# Altium schematic sheet Buck.SchDoc: Buck Converter
size Letter; DrawnBy: Adrianna Ascalon; Organization: UW Robotics; Address1: 200 University Avenue; Address2: Waterloo; Address3: Ontario; Address4: Canada N2L 3G6; SheetNumber: 1; SheetTotal: 2
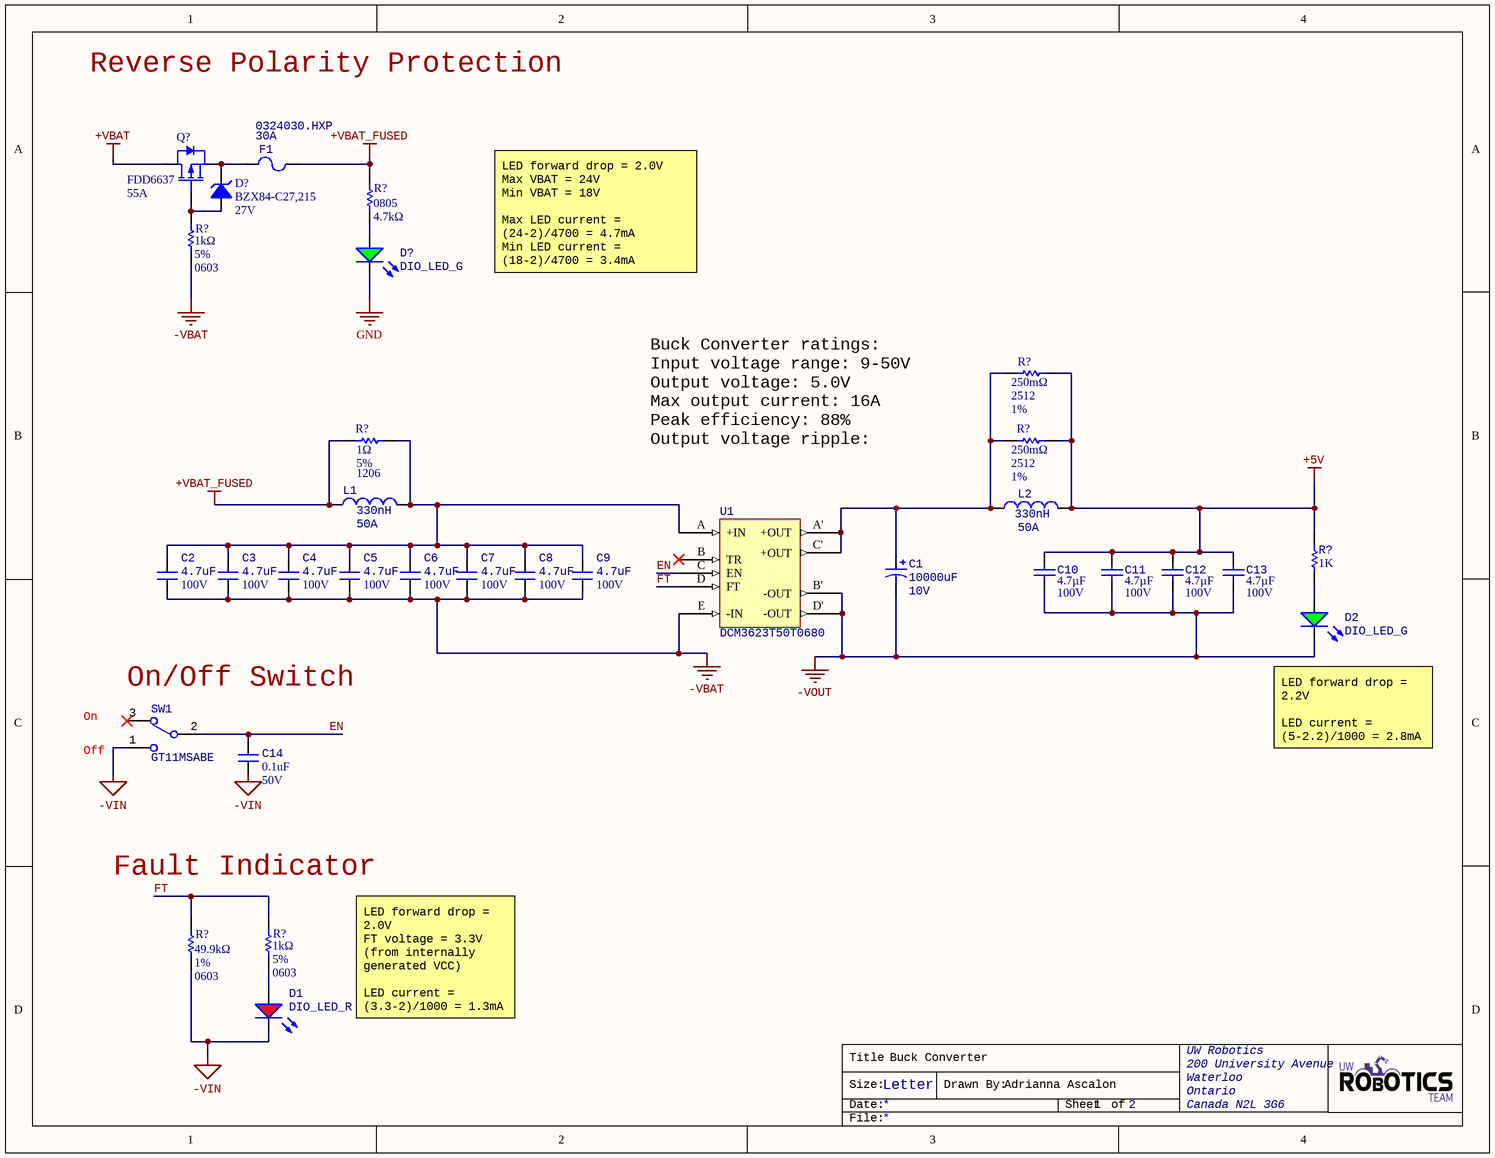
[diagram p0: Buck.SchDoc]

## Parts
(Parts that share a designator on the sheet are numbered #1, #2 ... from top to bottom, then left to right.)
C1  Capacitance: 10000uF  Voltage Rating: 10V  [CAP_UBY_18X25_NC]  (hidden comment: URS1A103MHD1TN)
C2  4.7uF  Voltage Rating: 100V  [CAPC5750X7R2A]
C3  4.7uF  Voltage Rating: 100V  [CAPC5750X7R2A]
C4  4.7uF  Voltage Rating: 100V  [CAPC5750X7R2A]
C5  4.7uF  Voltage Rating: 100V  [CAPC5750X7R2A]
C6  4.7uF  Voltage Rating: 100V  [CAPC5750X7R2A]
C7  4.7uF  Voltage Rating: 100V  [CAPC5750X7R2A]
C8  4.7uF  Voltage Rating: 100V  [CAPC5750X7R2A]
C9  4.7uF  Voltage Rating: 100V  [CAPC5750X7R2A]
C10  Capacitance: 4.7µF  Voltage Rating: 100V  [CAPC3216X190X50NL20T25]  (hidden comment: 12061Z475KAT2A)
C11  Capacitance: 4.7µF  Voltage Rating: 100V  [CAPC3216X190X50NL20T25]  (hidden comment: 12061Z475KAT2A)
C12  Capacitance: 4.7µF  Voltage Rating: 100V  [CAPC3216X190X50NL20T25]  (hidden comment: 12061Z475KAT2A)
C13  Capacitance: 4.7µF  Voltage Rating: 100V  [CAPC3216X190X50NL20T25]  (hidden comment: 12061Z475KAT2A)
C14  value 0.1uF  Voltage Rating: 50V  [CAPC0603(1608)55_N]  (hidden comment: CAP_0.1uF_50V_0603)
D1  DIO_LED_R  [LED_0805_LINE]
D2  DIO_LED_G  [LED_0805_LINE]
D?#1  Manufacturer Part Number 1: BZX84-C27,215  Working Voltage: 27V  [SOT23-3]  (hidden comment: DIO_ZENER_27V)
D?#2  DIO_LED_G  [LED_0805_LINE]
F1  0324030.HXP  Fuse Current: 30A
L1  Max DC Current: 50A  Inductance: 330nH  [WE-HCM 1390]  (hidden comment: 744309033)
L2  Max DC Current: 50A  Inductance: 330nH  [WE-HCM 1390]  (hidden comment: 744309033)
Q?  Continuous Drain Current (ID): 55A  (hidden comment: FDD6637)
R?#1  value 4.7kΩ  Case Code (Imperial): 0805  [RESC2012X60N]  (hidden comment: RES_4.7kΩ_0805)
R?#2  value 1kΩ  Tolerance: 5%  Case/Package: 0603  [RESC0603(1608)_N]  (hidden comment: RES_1kΩ_0603)
R?#3  Package Reference: 2512  Resistance Tolerance: 1%  Resistance: 250mΩ  [RESC6432X89X76NL25T25]  (hidden comment: WSL2512R2500FEA)
R?#4  Tolerance: 5%  Case Code (Imperial): 1206  Resistance: 1Ω  [RESC1206(3216)_N]  (hidden comment: RES_1Ω_1206)
R?#5  Package Reference: 2512  Resistance Tolerance: 1%  Resistance: 250mΩ  [RESC6432X89X76NL25T25]  (hidden comment: WSL2512R2500FEA)
R?#6  value 1K  [RESC0603(1608)_N]  (hidden comment: RES_1K_0603)
R?#7  Tolerance: 1%  Case/Package: 0603  Resistance: 49.9kΩ  [RESC0603(1608)_N]  (hidden comment: RES_49.9kΩ_0603)
R?#8  value 1kΩ  Tolerance: 5%  Case/Package: 0603  [RESC0603(1608)_N]  (hidden comment: RES_1kΩ_0603)
SW1  GT11MSABE
U1  DCM3623T50T0680  [DCM3623T50T0680]

## Nets
+5V: C10.2 C11.2 C12.2 C13.2 L2.2 R?#3.2 R?#5.2 R?#6.2
+VBAT: Q?.2(Drain)
+VBAT_FUSED: F1.2 L1.1 R?#1.2 R?#4.1
-VBAT: C2.1 C3.1 C4.1 C5.1 C6.1 C7.1 C8.1 C9.1 R?#2.1 U1.E(-IN)
-VIN: C14.1 D1.2(K) R?#7.2 SW1.1
-VOUT: C1.2 C10.1 C11.1 C12.1 C13.1 D2.2(K) U1.B'(-OUT) U1.D'(-OUT)
GND: D?#2.2(K)
EN: C14.2 SW1.2 U1.C(EN)
FT: R?#7.1 R?#8.2 U1.D(FT)
NetC1_1: C1.1 L2.1 R?#3.1 R?#5.1 U1.A'(+OUT) U1.C'(+OUT)
NetC2_2: C2.2 C3.2 C4.2 C5.2 C6.2 C7.2 C8.2 C9.2 L1.2 R?#4.2 U1.A(+IN)
NetD1_1: D1.1(A) R?#8.1
NetD2_1: D2.1(A) R?#6.1
NetD?#1_1: D?#1.1(Anode) Q?.1(Gate) R?#2.2
NetD?#1_3: D?#1.3(Cathode) F1.1 Q?.3(Source)
NetD?#2_1: D?#2.1(A) R?#1.1

Not connected (* = marked no-connect by the designer): SW1 3*; U1 B(TR)*

## Notes on the sheet
- Reverse Polarity Protection
- LED forward drop = 2.0V
  Max VBAT = 24V
  Min VBAT = 18V
  Max LED current = (24-2)/4700 = 4.7mA
  Min LED current = (18-2)/4700 = 3.4mA
- Buck Converter ratings:
  Input voltage range: 9-50V
  Output voltage: 5.0V
  Max output current: 16A
  Peak efficiency: 88%
  Output voltage ripple: 277mVpp
- (near SW1) On/Off Switch
- (near SW1) Off
- On
- (near D2) LED forward drop = 2.2V
  LED current = (5-2.2)/1000 = 2.8mA
- (near R?#8) Fault Indicator
- LED forward drop = 2.0V
  FT voltage = 3.3V (from internally generated VCC)
  LED current = (3.3-2)/1000 = 1.3mA
- Title
- Size:
- Date:
- Letter
- Drawn By:
- Sheet
- of
- File:

## Library data of the parts
C1 = URS1A103MHD1TN: CAP ALUM 10000UF 20% 10V RADIAL; Manufacturer 1: Nichicon; Ripple Current: 2.35A; Life (Hours): 2000Hour; Supplier 1: Digi-Key; Manufacturer Part Number 1: URS1A103MHD1TN; Stock 1: 703; Pricing 1: 1=2.34000, 10=1.89600, 100=1.44770 (USD); RoHS: Yes; Mount: Through Hole; Case/Package: Radial; Min Operating Temperature: -40°C; Max Operating Temperature: 85°C; Package Quantity: 250; Packaging: Tape and Reel; Tolerance: 20%; Lead Pitch: 0.295inch; Height - Seated (Max): 1.043inch; ComponentLink1URL: https://datasheet.ciiva.com/29548/e-rs-29548199.pdf?src-supplier=Digi-Key; ComponentLink1Description: https://datasheet.ciiva.com/29548/e-rs-29548199.pdf?src-supplier=Digi-Key; ComponentLink2URL: https://datasheet.ciiva.com/29548/e-rs-29548200.pdf?src-supplier=Digi-Key; ComponentLink2Description: https://datasheet.ciiva.com/29548/e-rs-29548200.pdf?src-supplier=Digi-Key; Supplier Part Number 1: 493-12364-1-ND
C2-C9 = CAP_4.7uF_100V_2220: CAP CER 4.7UF 100V X7R 2220; Manufacturer: TDK; Manufacturer Part Number: C5750X7R2A475M230KA; Tolerance: 20%; Supplier Part Number 1: 445-1450-1-ND; Supplier 1: Digi-Key; RoHS: Yes; Category: Ceramic Capacitors; Stock 1: 45989; Pricing 1: 1=2.58000, 10=2.08700, 100=1.59390 (USD); Mount: Surface Mount; Case/Package: 2220; Number of Pins: 2; Weight: 0.016932oz; Case Code (Metric): 5750; Case Code (Imperial): 2220; Min Operating Temperature: -55°C; Max Operating Temperature: 125°C; Termination: SMD/SMT; Voltage: 100V; Voltage Rating (DC): 100V; Dielectric: X7R; Packaging: Tape and Reel; Capacitance: 4.7uF; Package Quantity: 1; Composition: Ceramic; Length: 5.7mm; Height: 2.3mm; Depth: 5mm; Width: 0.197inch; Thickness: 0.098inch; Lead Free: Lead Free; REACH SVHC: No SVHC; ComponentLink1URL: https://datasheet.ciiva.com/24216/c5750x7r2a475m230ka-265798-24216581.pdf?src-supplier=Mouser; ComponentLink1Description: https://datasheet.ciiva.com/24216/c5750x7r2a475m230ka-265798-24216581.pdf?src-supplier=Mouser; ComponentLink2URL: https://datasheet.ciiva.com/16427/e413-c-16427893.pdf?src-supplier=Future+Electronics; ComponentLink2Description: https://datasheet.ciiva.com/16427/e413-c-16427893.pdf?src-supplier=Future+Electronics; ComponentLink3URL: https://datasheet.ciiva.com/28563/1484596-28563354.pdf?src-supplier=Element14; ComponentLink3Description: https://datasheet.ciiva.com/28563/1484596-28563354.pdf?src-supplier=Element14; ComponentLink4URL: https://datasheet.ciiva.com/22648/1642577-22648731.pdf?src-supplier=Element14; ComponentLink4Description: https://datasheet.ciiva.com/22648/1642577-22648731.pdf?src-supplier=Element14; Capacitor Value: 4.7uF
C10-C13 = 12061Z475KAT2A: Chip Capacitor, 4.7 uF, +/- 10%, 100 V, -55 to 125 degC, 1206 (3216 Metric), RoHS, Tape and Reel; Manufacturer: AVX; Dielectric Characteristic: X7S; SVHC: NoSVHC(17-Dec-2015); Ceramic Capacitor Case: 1206[3216Metric]; Packaging: CutTape; Datasheet Version: Oct-13; Operating Temperature Max: 125degC; Manufacturer URL: http://www.avx.com/; MSL: MSL1-Unlimited; Datasheet URL: https://datasheet.ciiva.com/22677/1789384-22677168.pdf; Capacitance Tolerance: ±10%; Operating Temperature Min: -55degC
C14 = CAP_0.1uF_50V_0603: CAP CER 0.1UF 50V X7R 0603; Manufacturer Part Number 1: CC0603KRX7R9BB104; Manufacturer 1: Yageo; Dimensions: 0.063" L x 0.031" W (1.60mm x 0.80mm); Package: 0603 (1608 Metric); Temperature Coefficient: X7R; Supplier Part Number 1: 311-1344-1-ND; Supplier 1: Digi-Key; Mount: Surface Mount
D1 = DIO_LED_R: LED RED DIFFUSED 0805 SMD; Manufacturer Part Number 1: LS R976-NR-1; Manufacturer 1: OSRAM; Forward Voltage Drop: 2V; Package: 0805 (2012 Metric); Supplier Part Number 1: 475-1278-1-ND; Supplier 1: Digi-Key; Mount: Surface Mount
D2 D?#2 = DIO_LED_G: LED GREEN DIFFUSED 0805 SMD; Manufacturer Part Number 1: LG R971-KN-1; Manufacturer 1: OSRAM; Forward Voltage Drop: 2.2V; Package: 0805 (2012 Metric); Supplier Part Number 1: 475-1410-1-ND; Supplier 1: Digi-Key; Mount: Surface Mount
D?#1 = DIO_ZENER_27V: DIODE ZENER 27V 250MW SOT23; Manufacturer 1: Nexperia USA Inc.; Tolerance: 5%; Forward Voltage: 0.9V; Supplier Part Number 1: 1727-5026-2-ND; Supplier 1: Digi-Key; Mount: Surface Mount; Package/Case: SOT-23-3
F1 = 0324030.HXP: FUSE, AXIAL, 30A, 6.3X32MM, FAST ACTING; Voltage Rating VAC:250V; Voltage Rating VDC:125V; Fuse Current:30A; Breaking Capacity:100A @ 250VAC / 1kA @ 75VDC / 400A @ 125VAC/VDC; Fuse Size Code:3AG; Fuse Size Metric:6.3mm x 32mm; Manufacturer 1: Littelfuse; Fuse Type: Cartridge, Ceramic; DC Cold Resistance: 1.82mR; Working Voltage: 250V; Voltage Rating (DC): 125V; Approvals: UL,CE,PSE,K-Mark; Supplier 1: Digi-Key; Manufacturer Part Number 1: 0324030.HXP; Stock 1: 124; Pricing 1: 1=2.28000, 5=2.17000, 10=2.06100, 50=1.66300, 100=1.40990, 250=1.37372, 500=1.15680, 1000=1.03028, 5000=0.90375 (USD); RoHS: Yes; Mount: Through Hole; Case/Package: Axial; Number of Pins: 2; Housing Material: Ceramic; Min Operating Temperature: -55°C; Max Operating Temperature: 125°C; Termination: Axial; Current: 30A; Current Rating: 30A; Package Quantity: 100; Packaging: Bulk; Resistance: 1.82mR; Voltage Rating (AC): 250V; Diameter: 6.985mm; Length: 32.72mm; Radiation Hardening: No; Lead Free: Lead Free; REACH SVHC: No SVHC; ComponentLink1URL: https://datasheet.ciiva.com/4485/littelfuse-fuse-314p-324p-185296-4485137.pdf?src-supplier=Mouser; ComponentLink1Description: https://datasheet.ciiva.com/4485/littelfuse-fuse-314p-324p-185296-4485137.pdf?src-supplier=Mouser; ComponentLink2URL: https://datasheet.ciiva.com/7462/littelfuse-fuse-314-324-7462439.pdf?src-supplier=Digi-Key; ComponentLink2Description: https://datasheet.ciiva.com/7462/littelfuse-fuse-314-324-7462439.pdf?src-supplier=Digi-Key; Supplier Part Number 1: F4845-ND
L1 L2 = 744309033: Wurth Shielded Wire-wound SMD Inductor with a MnZn Core, 0.33 µH ±20% Flat Wire Winding 47.5A Idc; Manufacturer 1: Wurth Electronics; Core Material: Zinc; Self Resonant Frequency: 158MHz; Saturation Current: 62.5A; DC Resistance (DCR): 0.165mR; Test Frequency: 100kHz; Supplier 1: Newark; Manufacturer Part Number 1: 744309033; Stock 1: 186; Pricing 1: 1=2.22000, 10=2.17000, 25=2.10000, 50=2.02000, 100=1.95000 (USD); RoHS: Yes; Mount: Surface Mount; Case/Package: Nonstandard; Min Operating Temperature: -40°C; Max Operating Temperature: 125°C; Inductance Tolerance: 20%; Package Quantity: 300; Current Rating: 47.5A; Tolerance: 20%; Shielding: Shielded; Packaging: Tape and Reel; Composition: Wirewound; Termination: SMD/SMT; RMS Current (Irms): 50A; Length: 0.551inch; Height: 9mm; Width: 0.512inch; Height - Seated (Max): 0.374inch; Lead Free: Lead Free; REACH SVHC: Unknown; ComponentLink1URL: https://datasheet.ciiva.com/6697/744309033-6697424.pdf?src-supplier=Digi-Key; ComponentLink1Description: https://datasheet.ciiva.com/6697/744309033-6697424.pdf?src-supplier=Digi-Key; ComponentLink2URL: https://datasheet.ciiva.com/7764/1645981-7764994.pdf?src-supplier=Element14; ComponentLink2Description: https://datasheet.ciiva.com/7764/1645981-7764994.pdf?src-supplier=Element14; ComponentLink3URL: https://datasheet.ciiva.com/13320/744309033-25565-13320700.pdf?src-supplier=Mouser; ComponentLink3Description: https://datasheet.ciiva.com/13320/744309033-25565-13320700.pdf?src-supplier=Mouser
Q? = FDD6637: Trans MOSFET P-CH 35V 13A 3-Pin(2+Tab) DPAK T/R; Manufacturer 1: ON Semiconductor / Fairchild; Rds On Max: 11.6mR; Input Capacitance: 2.37nF; Max Power Dissipation: 57W; Rise Time: 10ns; Fall Time: 36ns; Turn-Off Delay Time: 62ns; Turn-On Delay Time: 18ns; Gate to Source Voltage (Vgs): 25V; Element Configuration: Single; Number of Elements: 1; Power Dissipation: 3.1W; Drain to Source Breakdown Voltage: -35V; Threshold Voltage: -1.6V; Supplier 1: Digi-Key; Stock 1: 15110; Pricing 1: 1=1.02000, 10=0.90700, 25=0.86120, 100=0.64600, 250=0.63980, 500=0.54752, 1000=0.44602 (USD); RoHS: Yes; Mount: Surface Mount; Case/Package: TO-252; Number of Pins: 3; Weight: 0.26037g; Min Operating Temperature: -55°C; Max Operating Temperature: 150°C; Packaging: Tape and Reel; Drain to Source Voltage (Vdss): 35V; Package Quantity: 1; Drain to Source Resistance: 11.6mR; Nominal Vgs: -1.6V; On-State Resistance: 11.6MR; Length: 6.73mm; Height: 2.39mm; Width: 6.22mm; Radiation Hardening: No; Lead Free: Lead Free; REACH SVHC: No SVHC; ComponentLink1URL: https://datasheet.ciiva.com/34303/1958253-34303413.pdf?src-supplier=Jameco; ComponentLink1Description: https://datasheet.ciiva.com/34303/1958253-34303413.pdf?src-supplier=Jameco; ComponentLink2URL: https://datasheet.ciiva.com/15137/getdatasheetpartid-35276-15137060.pdf?src-supplier=Verical; ComponentLink2Description: https://datasheet.ciiva.com/15137/getdatasheetpartid-35276-15137060.pdf?src-supplier=Verical; ComponentLink3URL: https://datasheet.ciiva.com/4442/fdd6637-77901-4442502.pdf?src-supplier=Mouser; ComponentLink3Description: https://datasheet.ciiva.com/4442/fdd6637-77901-4442502.pdf?src-supplier=Mouser; ComponentLink4URL: https://datasheet.ciiva.com/25625/0900766b810c960f-25625341.pdf?src-supplier=RSComponents; ComponentLink4Description: https://datasheet.ciiva.com/25625/0900766b810c960f-25625341.pdf?src-supplier=RSComponents; ComponentLink5URL: https://datasheet.ciiva.com/26790/fdd6637-26790820.pdf?src-supplier=IIIC; ComponentLink5Description: https://datasheet.ciiva.com/26790/fdd6637-26790820.pdf?src-supplier=IIIC; ComponentLink6URL: https://datasheet.ciiva.com/6382/fdd6637-6382455.pdf?src-supplier=Digi-Key; ComponentLink6Description: https://datasheet.ciiva.com/6382/fdd6637-6382455.pdf?src-supplier=Digi-Key; ComponentLink7URL: https://datasheet.ciiva.com/28548/686553-28548172.pdf?src-supplier=Element14; ComponentLink7Description: https://datasheet.ciiva.com/28548/686553-28548172.pdf?src-supplier=Element14; ComponentLink8URL: https://datasheet.ciiva.com/6382/fdd6637-6382456.pdf?src-supplier=Digi-Key; ComponentLink8Description: https://datasheet.ciiva.com/6382/fdd6637-6382456.pdf?src-supplier=Digi-Key; ComponentLink9URL: https://datasheet.ciiva.com/6382/fdd6637-6382457.pdf?src-supplier=Digi-Key; ComponentLink9Description: https://datasheet.ciiva.com/6382/fdd6637-6382457.pdf?src-supplier=Digi-Key; Supplier Part Number 1: FDD6637CT-ND; Manufacturer Part Number 1: FDD6637
R?#1 = RES_4.7kΩ_0805: RES SMD 4.7K OHM 5% 1/8W 0805; Manufacturer 1: Yageo; Manufacturer Part Number 1: RC0805JR-074K7L; Resistance: 4.7kR; Temperature Coefficient: 100ppm/°C; Power Rating: 125mW; Voltage Rating: 150V; Supplier 1: Digi-Key; Stock 1: 2755291; Pricing 1: 1=0.10000, 10=0.03500, 100=0.01400, 1000=0.00631, 2500=0.00548 (USD); RoHS: Yes; Case/Package: Molded; Contact Plating: Tin,Lead,Matte; Case Code (Metric): 2012; Min Operating Temperature: -55°C; Max Operating Temperature: 155°C; Tolerance: 5%; Packaging: Tape and Reel; Composition: Thick Film; Termination: SMD/SMT; Military Standard: Not; Length: 2mm; Depth: 1.25mm; Radiation Hardening: No; REACH SVHC: Unknown; Lead Free: Lead Free; ComponentLink1URL: https://datasheet.ciiva.com/7941/442941-7941973.pdf?src-supplier=Element14; ComponentLink1Description: https://datasheet.ciiva.com/7941/442941-7941973.pdf?src-supplier=Element14; ComponentLink2URL: https://datasheet.ciiva.com/7941/442941-7941974.pdf?src-supplier=Element14; ComponentLink2Description: https://datasheet.ciiva.com/7941/442941-7941974.pdf?src-supplier=Element14; ComponentLink3URL: https://datasheet.ciiva.com/17486/rc0805-17486827.pdf?src-supplier=Future+Electronics; ComponentLink3Description: https://datasheet.ciiva.com/17486/rc0805-17486827.pdf?src-supplier=Future+Electronics; ComponentLink4URL: https://datasheet.ciiva.com/12667/rc0805-12667037.pdf?src-supplier=Mouser; ComponentLink4Description: https://datasheet.ciiva.com/12667/rc0805-12667037.pdf?src-supplier=Mouser; Supplier Part Number 1: 311-4.7KARCT-ND; Mount: Surface Mount
R?#2 R?#8 = RES_1kΩ_0603: RES SMD 1K OHM 5% 1/10W 0603; Manufacturer 1: Yageo; Manufacturer Part Number 1: RC0603JR-071KL; Dimensions: 0.063" L x 0.031" W (1.60mm x 0.80mm); Package: 0603 (1608 Metric); Supplier Part Number 1: 311-1.0KGRCT-ND; Supplier 1: Digi-Key; Mount: Surface Mount; Case Code (Metric): 1608
R?#3 R?#5 = RES_250mΩ_2512: Chip Resistor, 250 mOhm, +/- 1%, 1 W, -65 to 170 degC, 2512 (6432 Metric), RoHS, Tape and Reel; Manufacturer: Vishay; Power Rating: 1W; Automotive Qualification Standard: AEC-Q200; Temperature Coefficient: ±75ppm/°C; Resistor Case Style: 2512[6432Metric]; SVHC: NoSVHC(15-Jun-2015); Product Range: WSLSeries; Resistor Element Type: MetalStrip; Manufacturer URL: http://www.vishay.com/; Datasheet Version: 07/2016; Datasheet URL: http://www.vishay.com/docs/30100/wsl.pdf; Mounting Technology: SurfaceMount; MSL: MSL1-Unlimited; Package Description: 2-Pin Surface Mount Device, Body 6.35 x 3.18 mm; Packaging: CutTape
R?#4 = RES_1Ω_1206: RES 1 OHM 5% 1/4W 1206; Manufacturer: KOA Speer; Manufacturer Part Number: RK73B2BTTE1R0J; Power Rating: 250mW; Voltage Rating: 200V; Temperature Coefficient: 200ppm/°C; Supplier 1: Digi-Key; RoHS: Yes; Category: Chip SMD Resistors; Stock 1: 3828; Pricing 1: 1=0.10000, 10=0.04600, 100=0.01880, 1000=0.00845 (USD); Case/Package: 1206; Case Code (Metric): 3216; Min Operating Temperature: -55°C; Max Operating Temperature: 155°C; Packaging: Tape and Reel; Package Quantity: 4000; Termination: SMD/SMT; Composition: Thick Film; Length: 3.2mm; Height: 0.6mm; Width: 1.6mm; ComponentLink1URL: https://datasheet.ciiva.com/5555/rk73b-5555368.pdf?src-supplier=Mouser; ComponentLink1Description: https://datasheet.ciiva.com/5555/rk73b-5555368.pdf?src-supplier=Mouser; Supplier Part Number 1: 2019-RK73B2BTTE1R0JCT-ND
R?#6 = RES_1K_0603: RES SMD 1K OHM 5% 1/10W 0603; Manufacturer 1: Yageo; Manufacturer Part Number 1: RC0603JR-071KL; Dimensions: 0.063" L x 0.031" W (1.60mm x 0.80mm); Tolerance: 5%; Package: 0603 (1608 Metric); Supplier Part Number 1: 311-1.0KGRCT-ND; Supplier 1: Digi-Key; Mount: Surface Mount
R?#7 = RES_49.9kΩ_0603: RES 49.9K OHM 1% 1/10W 0603; Manufacturer: KOA Speer; Manufacturer Part Number 1: RK73H1JTTD4992F; Power Rating: 100mW; Voltage Rating: 50V; Temperature Coefficient: 100ppm/°C; Value: 49.9kΩ; Supplier 1: Digi-Key; RoHS: Yes; Category: Chip SMD Resistors; Stock 1: 339046; Pricing 1: 1=0.10000, 10=0.02200, 100=0.00910, 1000=0.00408, 2500=0.00354 (USD); Mount: Surface Mount; Number of Pins: 2; Min Operating Temperature: -55°C; Max Operating Temperature: 155°C; Composition: Thick Film; Packaging: Tape and Reel; Package Quantity: 5000; Termination: SMD/SMT; Military Standard: Not; Voltage Rating (DC): 50V; Length: 1.6mm; Height: 0.45mm; Width: 0.8mm; Lead Free: Lead Free; ComponentLink1URL: https://datasheet.ciiva.com/5555/rk73h-5555450.pdf?src-supplier=Mouser; ComponentLink1Description: https://datasheet.ciiva.com/5555/rk73h-5555450.pdf?src-supplier=Mouser; ComponentLink2URL: https://datasheet.ciiva.com/7693/549017-7693854.pdf?src-supplier=Element14; ComponentLink2Description: https://datasheet.ciiva.com/7693/549017-7693854.pdf?src-supplier=Element14; Supplier Part Number 1: 2019-RK73H1JTTD4992FCT-ND; Dimensions: 0.063" L x 0.031" W (1.60mm x 0.80mm); Package: 0603 (1608 Metric); Case Code (Metric): 1608; Depth: 0.8mm
SW1 = GT11MSABE: SWITCH, TOGGLE, SPDT, 20V; Manufacturer 1: ITT C&K; Mechanical Life: 40000Cycles; Actuator Material: Nylon,Glass,Polyamide; Actuator Type: Standard Round; Power Rating: 400mW; Illumination Type: Non-Illuminated; Switch Function: On-On; Actuator Length: 3.81mm; Supplier 1: Digi-Key; Manufacturer Part Number 1: GT11MSABE; Stock 1: 3465; Pricing 1: 1=6.06000, 10=5.45900, 25=5.18640, 50=4.96780, 100=4.80410, 250=4.55840 (USD); RoHS: Yes; Mount: Surface Mount,Brackets; Contact Material: Copper Alloy; Contact Plating: Gold; Housing Material: Nylon; Min Operating Temperature: -30°C; Max Operating Temperature: 85°C; Termination: Gull Wing; Throw Configuration: SPDT; Max Voltage Rating (DC): 20V; Electrical Life: 40000Cycles; Orientation: Right Angle; Voltage Rating (AC): 20V; Voltage Rating (DC): 20V; Packaging: Tape and Reel; Package Quantity: 1; Max Voltage Rating (AC): 20V; Length: 7.01mm; Depth: 12.45mm; Lead Free: Lead Free; ComponentLink1URL: https://datasheet.ciiva.com/2904/gt-1oct13-2904374.pdf?src-supplier=Digi-Key; ComponentLink1Description: https://datasheet.ciiva.com/2904/gt-1oct13-2904374.pdf?src-supplier=Digi-Key; ComponentLink2URL: https://datasheet.ciiva.com/2904/gt-1oct13-2904375.pdf?src-supplier=Digi-Key; ComponentLink2Description: https://datasheet.ciiva.com/2904/gt-1oct13-2904375.pdf?src-supplier=Digi-Key; ComponentLink3URL: https://datasheet.ciiva.com/2904/gt-1oct13-2904376.pdf?src-supplier=Digi-Key; ComponentLink3Description: https://datasheet.ciiva.com/2904/gt-1oct13-2904376.pdf?src-supplier=Digi-Key; ComponentLink4URL: https://datasheet.ciiva.com/16166/gt-1oct13-16166152.pdf?src-supplier=Onlinecomponents.com; ComponentLink4Description: https://datasheet.ciiva.com/16166/gt-1oct13-16166152.pdf?src-supplier=Onlinecomponents.com; Supplier Part Number 1: CKN1783CT-ND